# Altium schematic sheet 5Vto3V3.SchDoc
size A
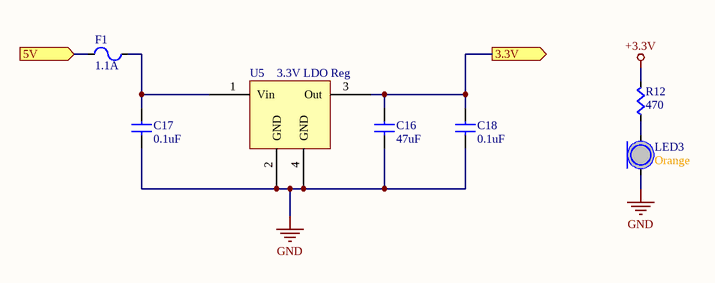
[diagram p0: 5Vto3V3.SchDoc]

## Parts
C16  value 47uF  [CAPC1206]  (hidden comment: Cap)
C17  value 0.1uF  [CAPC0603]  (hidden comment: Cap)
C18  value 0.1uF  [CAPC0603]  (hidden comment: Cap)
F1  value 1.1A  [PTC7451X11N]  (hidden comment: PTC Fuse)
LED3  Color: Orange  [LED0603]  (hidden comment: LED)
R12  value 470  [RES0603]  (hidden comment: Res)
U5  3.3V LDO Reg  [SOT23-4n]

## Ports
3.3V (out), 5V (in)

## Nets
+3.3V: R12.1(A)
GND: C16.1(A) C17.2(B) C18.2(B) LED3.C U5.2(GND) U5.4(GND)
3.3V: C16.2(B) C18.1(A) U5.3(Out) ; port 3.3V
5V: F1.1(A) ; port 5V
NetC17_1: C17.1(A) F1.2(B) U5.1(Vin)
NetLED3_A: LED3.A R12.2(B)

## Library data of the parts
C16 = Cap: CAP CER 47UF 10V X5R 1206; Supplier 1: Digi-Key; Supplier Part Number 1: 399-5508-1-ND
C17 C18 = Cap: CAP CER 0.1UF 50V X7R 0603; Supplier 1: Digi-Key; Supplier Part Number 1: 1276-1000-1-ND
F1 = PTC_Fuse: PTC RESTTBLE 33V 1.10A CHIP 2920; Supplier 1: Digi-Key; Supplier Part Number 1: 507-1744-1-ND
LED3 = LED: LED ORANGE CLEAR 0603 SMD; Supplier 1: Digi-Key; Supplier Part Number 1: 754-1120-1-ND
R12 = Res: RES SMD 470 OHM 1% 1/10W 0603; Supplier 1: Digi-Key; Supplier Part Number 1: 311-470HRCT-ND
U5 = LM3940IMPX-3.3: IC REG LDO 3.3V 1A SOT223; Supplier 1: Digi-Key; Supplier Part Number 1: LM3940IMPX-3.3/NOPBCT-ND